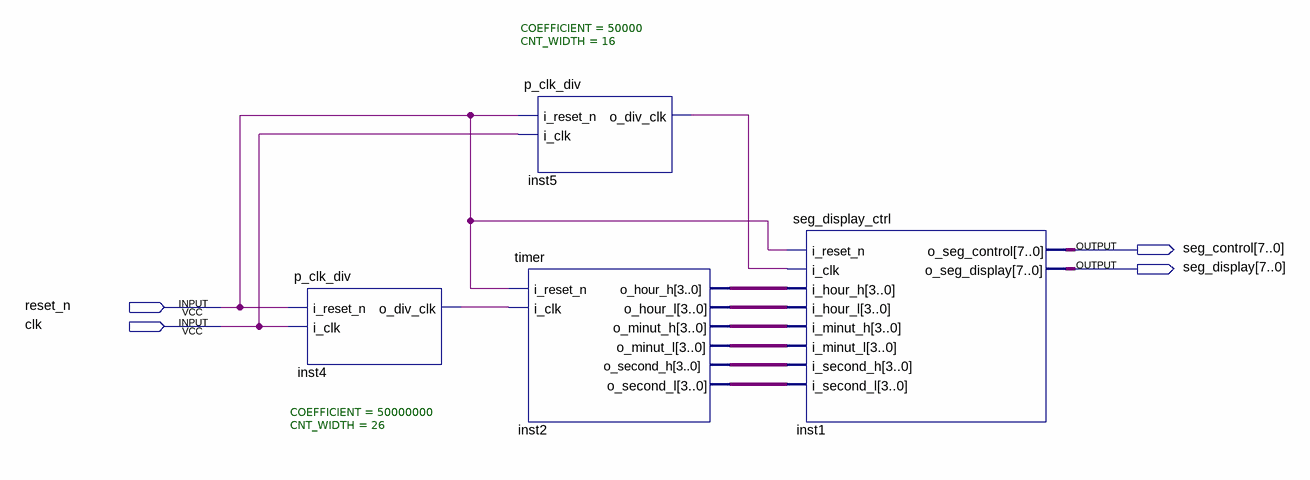
[diagram p0: schematic sheet]
// Quartus schematic seg_clock_top.bdf as structural Verilog: 4 symbols, 4 pins
module seg_clock_top (
  input  reset_n,
  input  clk,
  output [7:0] seg_control,
  output [7:0] seg_display
);

  wire inst4_o_div_clk, inst5_o_div_clk;
  wire [3:0] inst2_o_hour_h, inst2_o_hour_l, inst2_o_minut_h, inst2_o_minut_l, inst2_o_second_h,
       inst2_o_second_l;

  p_clk_div #(.COEFFICIENT(50000000), .CNT_WIDTH(26)) inst4 (
    .i_reset_n(reset_n), .i_clk(clk), .o_div_clk(inst4_o_div_clk));
  p_clk_div #(.COEFFICIENT(50000), .CNT_WIDTH(16)) inst5 (
    .i_reset_n(reset_n), .i_clk(clk), .o_div_clk(inst5_o_div_clk));
  timer inst2 (
    .i_reset_n(reset_n), .i_clk(inst4_o_div_clk), .o_hour_h(inst2_o_hour_h), .o_hour_l(inst2_o_hour_l),
    .o_minut_h(inst2_o_minut_h), .o_minut_l(inst2_o_minut_l), .o_second_h(inst2_o_second_h),
    .o_second_l(inst2_o_second_l));
  seg_display_ctrl inst1 (
    .i_reset_n(reset_n), .i_clk(inst5_o_div_clk), .i_hour_h(inst2_o_hour_h), .i_hour_l(inst2_o_hour_l),
    .i_minut_h(inst2_o_minut_h), .i_minut_l(inst2_o_minut_l), .i_second_h(inst2_o_second_h),
    .i_second_l(inst2_o_second_l), .o_seg_control(seg_control), .o_seg_display(seg_display));
endmodule
